# Altium project fNIRS_CableAssembly.PrjPcb
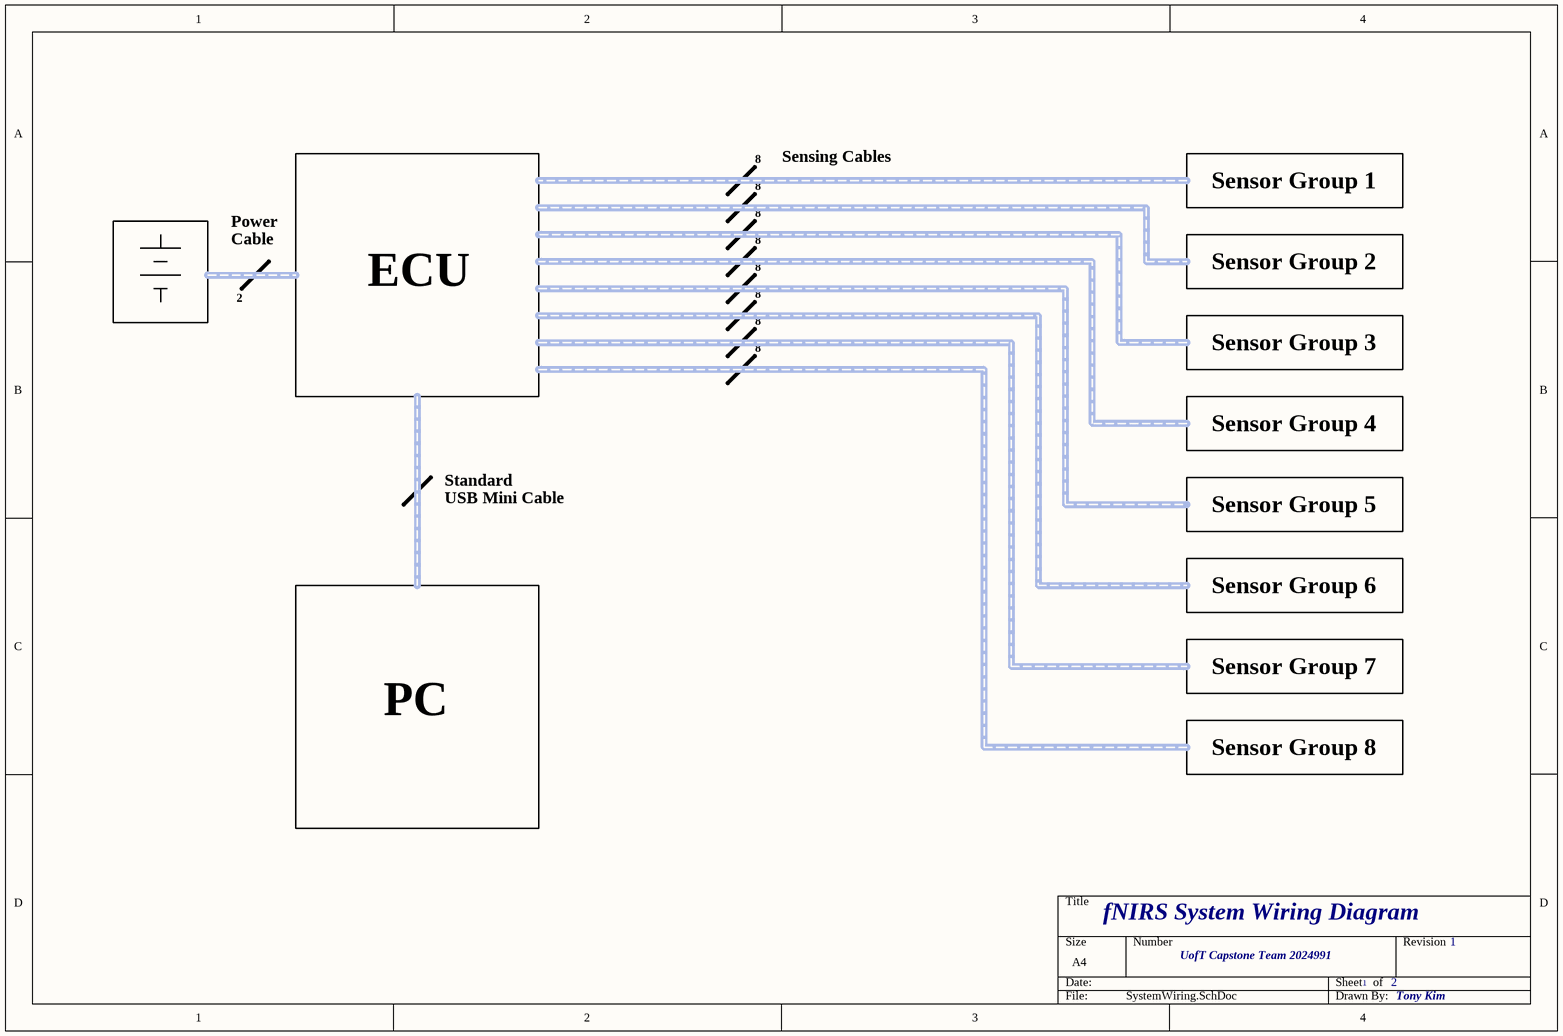
[diagram p0: SystemWiring.SchDoc]
3 sheets, 5 parts. Net scope: global (net labels, ports and power ports of the same name join across sheets).
Sheets:
  SystemWiring.SchDoc
  SensingCables.SchDoc
  PowerCable.SchDoc

## Sheet SystemWiring.SchDoc: fNIRS System Wiring Diagram
size A4; CompanyName: UofT Capstone Team 2024991; DrawnBy: Tony Kim; Revision: 1; SheetNumber: 1; SheetTotal: 2

### Notes on the sheet
- 8
- Sensing Cables
- Sensor Group 1
- Power
- Cable
- 2
- ECU
- Sensor Group 2
- Sensor Group 3
- Sensor Group 4
- USB Mini Cable
- Standard
- Sensor Group 5
- Sensor Group 6
- Sensor Group 7
- PC
- Sensor Group 8

## Sheet SensingCables.SchDoc: Sensing Cable Wiring Diagram
size A4; CompanyName: UofT Capstone Team 2024991; DrawnBy: Tony Kim; Revision: 1; SheetNumber: 2; SheetTotal: 2
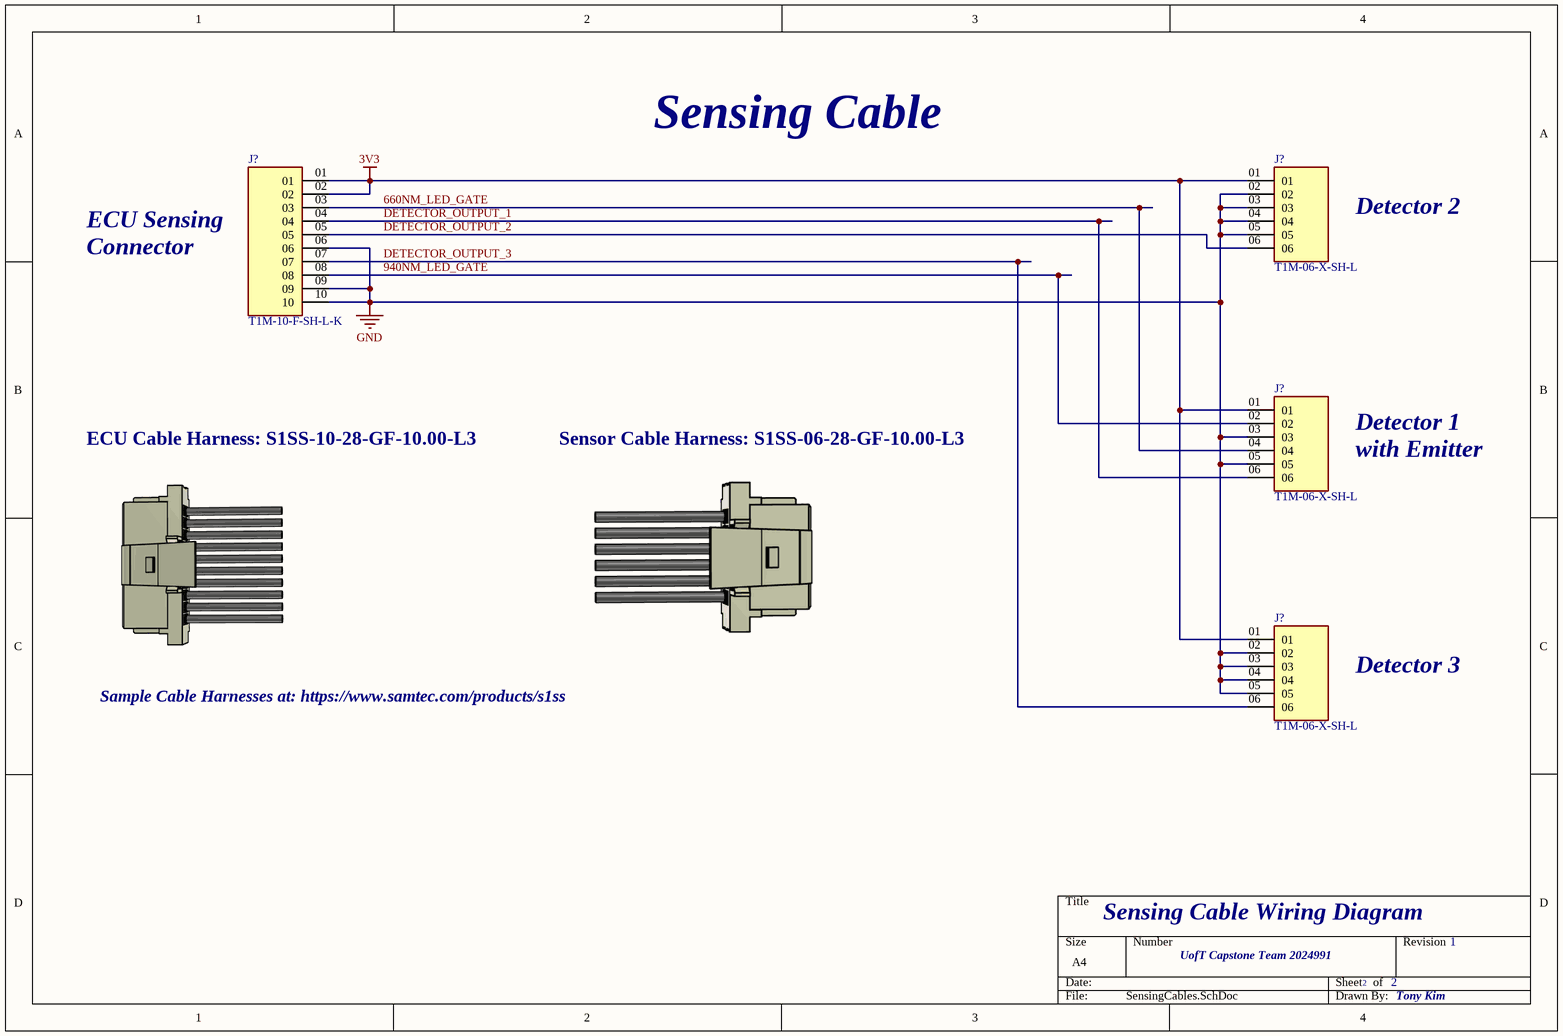
[diagram p1: SensingCables.SchDoc]

### Parts
(Parts that share a designator on the sheet are numbered #1, #2 ... from top to bottom, then left to right.)
J?#1  T1M-06-X-SH-L  [SAMTEC_T1M-06-X-SH-L]
J?#2  T1M-10-F-SH-L-K  [SAMTEC_T1M-10-F-SH-L-K]
J?#3  T1M-06-X-SH-L  [SAMTEC_T1M-06-X-SH-L]
J?#4  T1M-06-X-SH-L  [SAMTEC_T1M-06-X-SH-L]

### Nets
3V3: J?#1.01 J?#2.01 J?#2.02 J?#3.01 J?#4.01
GND: J?#1.02 J?#1.03 J?#1.04 J?#1.05 J?#2.06 J?#2.09 J?#2.10 J?#3.03 J?#3.05 J?#4.02 J?#4.03 J?#4.04 J?#4.05
660NM_LED_GATE: J?#2.03 J?#3.04
940NM_LED_GATE: J?#2.08 J?#3.02
DETECTOR_OUTPUT_1: J?#2.04 J?#3.06
DETECTOR_OUTPUT_2: J?#1.06 J?#2.05
DETECTOR_OUTPUT_3: J?#2.07 J?#4.06

### Notes on the sheet
- Sensing Cable
- ECU Sensing
- Detector 2
- Connector
- ECU Cable Harness: S1SS-10-28-GF-10.00-L3
- Sensor Cable Harness: S1SS-06-28-GF-10.00-L3
- Detector 1
- with Emitter
- Sample Cable Harnesses at: https://www.samtec.com/products/s1ss
- Detector 3

### Library data of the parts
J?#1 J?#3 J?#4 = T1M-06-X-SH-L: Connector Header Surface Mount, Right Angle 6 position 0.039" (1.00mm); MF: Samtec; Availability: Unavailable; Value: *; Price: None; MP: T1M-06-X-SH-L; Package: None
J?#2 = T1M-10-F-SH-L-K: MF: Samtec; Value: *; Package: None; MP: T1M-10-F-SH-L-K; Price: None; Availability: Unavailable

## Sheet PowerCable.SchDoc: Power Cable
size A4; CompanyName: UofT Capstone Team 2024991; DrawnBy: Tony Kim; Revision: 1; SheetNumber: 3; SheetTotal: 3
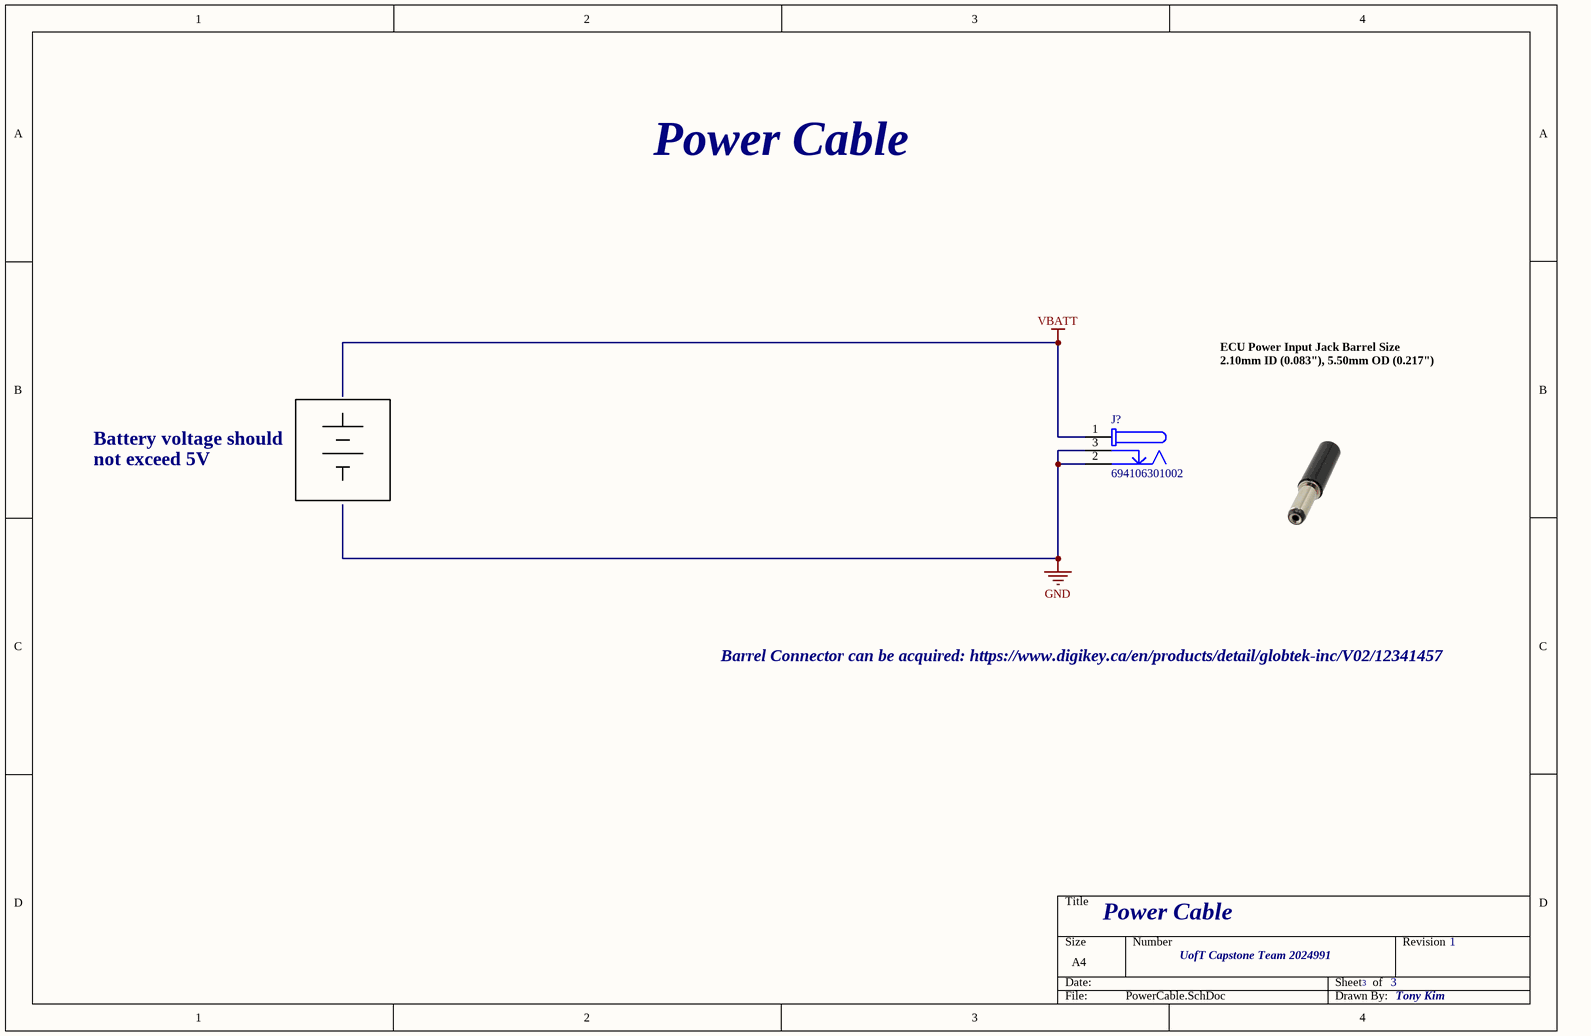
[diagram p2: PowerCable.SchDoc]

### Parts
(Parts that share a designator on the sheet are numbered #1, #2 ... from top to bottom, then left to right.)
J?#5  694106301002  [694106301002]

### Nets
GND: J?#5.2 J?#5.3
VBATT: J?#5.1

### Notes on the sheet
- Power Cable
- 2.10mm ID (0.083"), 5.50mm OD (0.217")
- ECU Power Input Jack Barrel Size
- Battery voltage should
- not exceed 5V
- Barrel Connector can be acquired: https://www.digikey.ca/en/products/detail/globtek-inc/V02/12341457

### Library data of the parts
J?#5 = CMP-1502-00188-2: NexarPartId: 52676100; Voltage Rating (DC): 20V; Gender: Male; Voltage Rating: 24V; Connector Type: Power; Insulation Resistance: 100MΩ; Current Rating: 5A; Shielding: Unshielded; Number of Contacts: 3; Color: Black; Housing Material: Polyamide; Contact Gender: Female; REACH SVHC: Unknown; Termination: Through Hole; Height: 11mm; RoHS: Compliant; Mount: Through Hole; Flammability Rating: UL94 V-0; Packaging: Bulk; Min Operating Temperature: -40°C; Contact Plating: Tin; Max Operating Temperature: 85°C; Operating Supply Voltage: 24V; Contact Material: Gold, Tin

## Nets that join several sheets
GND: SensingCables (13 pins), PowerCable (J?#5.2 J?#5.3)